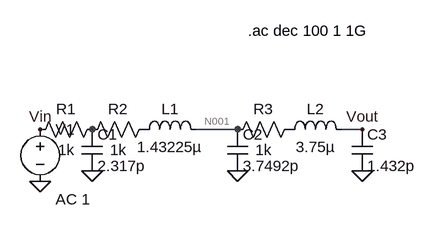
[diagram p0: schematic MaxFlat.asc]
MaxFlat.asc, the LTspice schematic file:
Version 4
SHEET 1 880 680
WIRE 416 48 352 48
WIRE 608 48 576 48
FLAG 192 112 0
FLAG 416 112 0
FLAG 608 112 0
FLAG 112 128 0
FLAG 112 48 Vin
FLAG 608 48 Vout
SYMBOL res 208 32 R90
WINDOW 0 0 56 VBottom 2
WINDOW 3 32 56 VTop 2
SYMATTR InstName R1
SYMATTR Value 1k
SYMBOL cap 176 48 R0
SYMATTR InstName C1
SYMATTR Value 2.317p
SYMBOL cap 400 48 R0
SYMATTR InstName C2
SYMATTR Value 3.7492p
SYMBOL cap 592 48 R0
SYMATTR InstName C3
SYMATTR Value 1.432p
SYMBOL res 288 32 R90
WINDOW 0 0 56 VBottom 2
WINDOW 3 32 56 VTop 2
SYMATTR InstName R2
SYMATTR Value 1k
SYMBOL res 512 32 R90
WINDOW 0 0 56 VBottom 2
WINDOW 3 32 56 VTop 2
SYMATTR InstName R3
SYMATTR Value 1k
SYMBOL ind 256 64 R270
WINDOW 0 32 56 VTop 2
WINDOW 3 5 56 VBottom 2
SYMATTR InstName L1
SYMATTR Value 1.43225µ
SYMBOL ind 480 64 R270
WINDOW 0 32 56 VTop 2
WINDOW 3 5 56 VBottom 2
SYMATTR InstName L2
SYMATTR Value 3.75µ
SYMBOL voltage 112 32 R0
WINDOW 123 24 124 Left 2
WINDOW 39 0 0 Left 0
SYMATTR Value2 AC 1
SYMATTR InstName V1
SYMATTR Value ""
TEXT 432 -104 Left 2 !.ac dec 100 1 1G

The netlist it stands for:
* MaxFlat.asc
R1 P001 Vin 1k
C1 P001 0 2.317p
C2 N001 0 3.7492p
C3 Vout 0 1.432p
R2 P002 P001 1k
R3 P003 N001 1k
L1 P002 N001 1.43225µ
L2 P003 Vout 3.75µ
V1 Vin 0 AC 1
.ac dec 100 1 1G
.backanno
.end

* Results of the author's LTspice run, read from the files saved beside the schematic
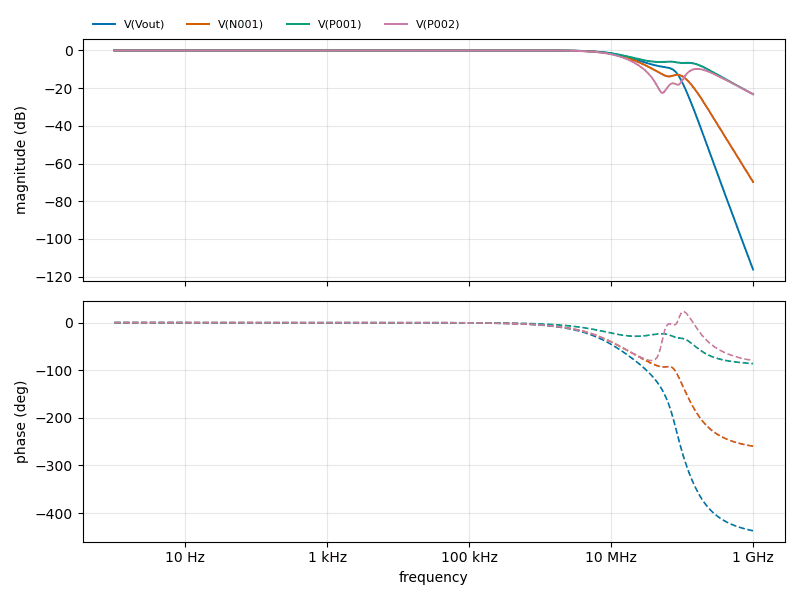
[diagram p1: AC Analysis of MaxFlat.asc, plotted from the saved traces]
* AC Analysis, 1 run:
*   V(Vout): 0.00 dB at 1 Hz, -116.23 dB at 1 GHz, peak 0.00 dB at 4.365 Hz, 3 dB below the peak at 14.89 MHz
*   V(N001): 0.00 dB at 1 Hz, -69.74 dB at 1 GHz, peak 0.00 dB at 4.365 Hz, 3 dB below the peak at 13.85 MHz
*   V(P001): 0.00 dB at 1 Hz, -23.22 dB at 1 GHz, peak 0.00 dB at 4.365 Hz, 3 dB below the peak at 16.08 MHz
*   V(P002): 0.00 dB at 1 Hz, -23.27 dB at 1 GHz, peak 0.00 dB at 4.365 Hz, 3 dB below the peak at 12.55 MHz